# EAGLE design dual_switches (EAGLE 9.3.1)
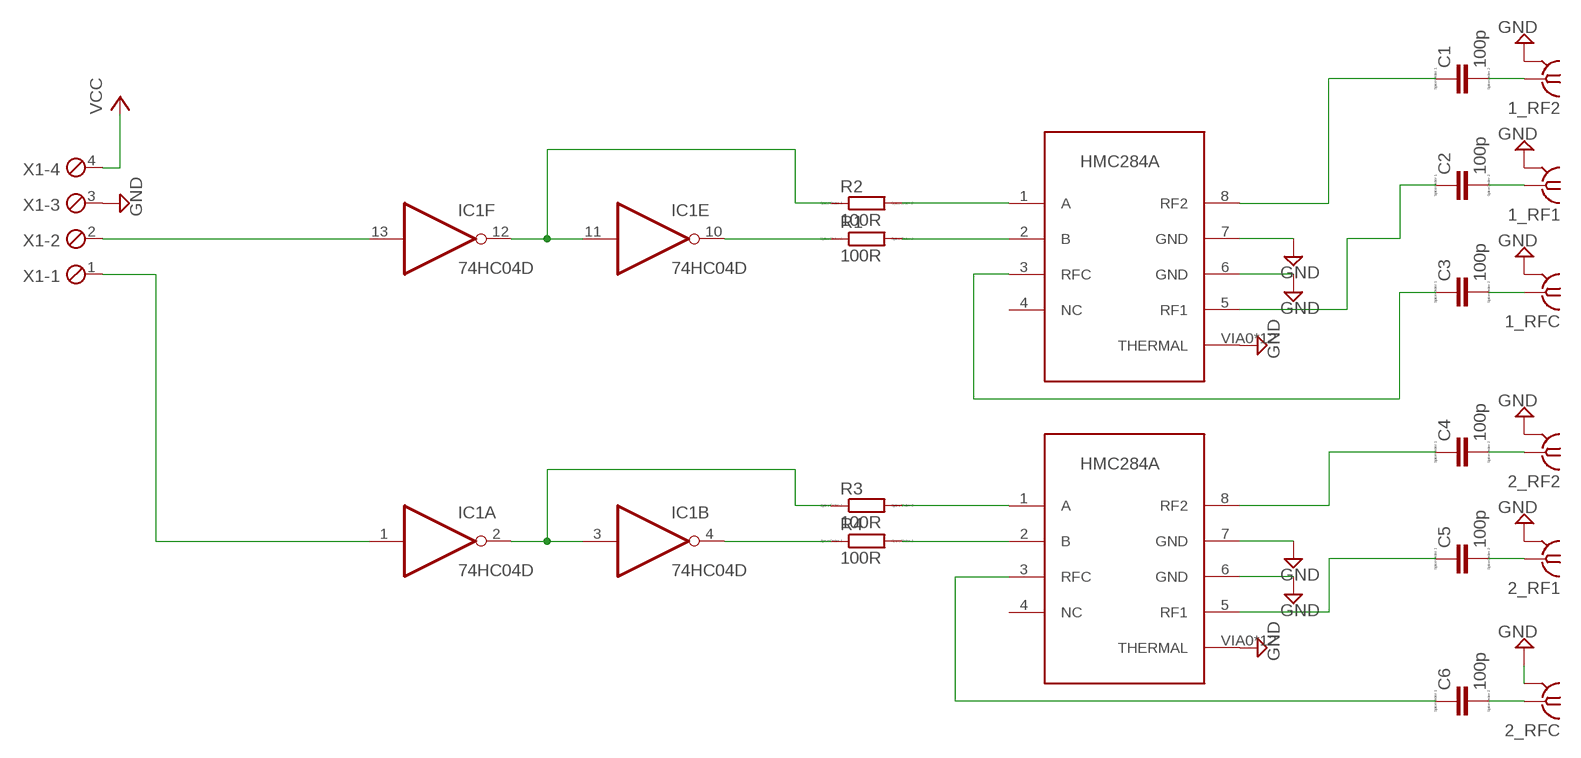
[diagram p0: schematic, sheet 1]

## Parts
1_RF1  SMA-142-0701-801/806  [J502-ND-142-0701-801/806]
1_RF2  SMA-142-0701-801/806  [J502-ND-142-0701-801/806]
1_RFC  SMA-142-0701-801/806  [J502-ND-142-0701-801/806]
2_RF1  SMA-142-0701-801/806  [J502-ND-142-0701-801/806]
2_RF2  SMA-142-0701-801/806  [J502-ND-142-0701-801/806]
2_RFC  SMA-142-0701-801/806  [J502-ND-142-0701-801/806]
C1  100p  CC0402  [C0402]
C2  100p  CC0402  [C0402]
C3  100p  CC0402  [C0402]
C4  100p  CC0402  [C0402]
C5  100p  CC0402  [C0402]
C6  100p  CC0402  [C0402]
IC1  74HC04D  [SO14]
R1  100R  RR0603  [R0603]
R2  100R  RR0603  [R0603]
R3  100R  RR0603  [R0603]
R4  100R  RR0603  [R0603]
U$1  HMC284A  [MSOP-8G]
U$2  HMC284A  [MSOP-8G]
X1  MPT4  [4POL254]

## Nets
GND: 1_RF1.G@1 1_RF1.G@2 1_RF1.G@3 1_RF1.G@4 1_RF2.G@1 1_RF2.G@2 1_RF2.G@3 1_RF2.G@4 1_RFC.G@1 1_RFC.G@2 1_RFC.G@3 1_RFC.G@4 2_RF1.G@1 2_RF1.G@2 2_RF1.G@3 2_RF1.G@4 2_RF2.G@1 2_RF2.G@2 2_RF2.G@3 2_RF2.G@4 2_RFC.G@1 2_RFC.G@2 2_RFC.G@3 2_RFC.G@4 U$1.6(GND) U$1.7(GND) U$1.VIA0(THERMAL) U$1.VIA1(THERMAL) U$1.VIA2(THERMAL) U$1.VIA3(THERMAL) U$1.VIA5(THERMAL) U$1.VIA6(THERMAL) U$1.VIA7(THERMAL) U$1.VIA8(THERMAL) U$1.VIA9(THERMAL) U$1.VIA10(THERMAL) U$1.VIA11(THERMAL) U$1.VIA12(THERMAL) U$2.6(GND) U$2.7(GND) U$2.VIA0(THERMAL) U$2.VIA1(THERMAL) U$2.VIA2(THERMAL) U$2.VIA3(THERMAL) U$2.VIA5(THERMAL) U$2.VIA6(THERMAL) U$2.VIA7(THERMAL) U$2.VIA8(THERMAL) U$2.VIA9(THERMAL) U$2.VIA10(THERMAL) U$2.VIA11(THERMAL) U$2.VIA12(THERMAL) X1.3
N$1 [Trace_normal]: IC1.13(F:I) X1.2
N$2 [Trace_normal]: IC1.11(E:I) IC1.12(F:O) R2.1
N$3 [Trace_normal]: IC1.2(A:O) IC1.3(B:I) R3.1
N$5 [Trace_normal]: R1.2 U$1.2(B)
N$6: C1.1 U$1.8(RF2)
N$7 [Trace_normal]: IC1.1(A:I) X1.1
N$8 [Trace_normal]: IC1.10(E:O) R1.1
N$9: C3.1 U$1.3(RFC)
N$10: C2.1 U$1.5(RF1)
N$11: C4.1 U$2.8(RF2)
N$12: C5.1 U$2.5(RF1)
N$13: C6.1 U$2.3(RFC)
N$14 [Trace_normal]: R2.2 U$1.1(A)
N$15 [Trace_normal]: R3.2 U$2.1(A)
N$16 [Trace_normal]: R4.2 U$2.2(B)
N$17: 2_RF1.1 C5.2
N$18: 2_RFC.1 C6.2
N$19: 2_RF2.1 C4.2
N$20: 1_RFC.1 C3.2
N$21: 1_RF1.1 C2.2
N$22: 1_RF2.1 C1.2
N$24 [Trace_normal]: IC1.4(B:O) R4.1
VCC: X1.4
Unconnected: IC1.5(C:I) IC1.6(C:O) IC1.8(D:O) IC1.9(D:I) U$1.4(NC) U$2.4(NC)

## Power pins joined to a net without a drawn wire
GND: IC1.7(P:GND)
VCC: IC1.14(P:VCC)

## Library data of the parts
1_RF1 1_RF2 1_RFC 2_RF1 2_RF2 2_RFC = con-coax:SMA-: SMA 50 Ohm End Launch Jack Receptacle - Round Contact Johnson Components Source: www.johnsoncomponents.com .. J502-ND.pdf; MF: JOHNSON COMPONENTS; MPN: 142-0701-801; OC_FARNELL: 1608592; OC_NEWARK: 90F2624
C1-C6 = eagle-ltspice:C: CAPACITOR, European symbol; SPICEMODEL: NONE; SPICEPREFIX: C
IC1 = 74xx-eu:74*04: Hex INVERTER
R1-R4 = eagle-ltspice:R: RESISTOR, European symbol; SPICEMODEL: NONE; SPICEPREFIX: R
U$1 U$2 = my_library:HMC284A: HMC284A DC - 3.5GHz dual RF switch
X1 = con-phoenix-254:MPT4: PHOENIX CONNECTOR; OC_FARNELL: unknown; OC_NEWARK: unknown

## Net classes
0 CPW_G: width 0.35 mm, drill 0.2 mm, clearance 0.2 mm
1 Trace_normal: width 0.15 mm, drill 0.2 mm, clearance 0.2 mm

## Board
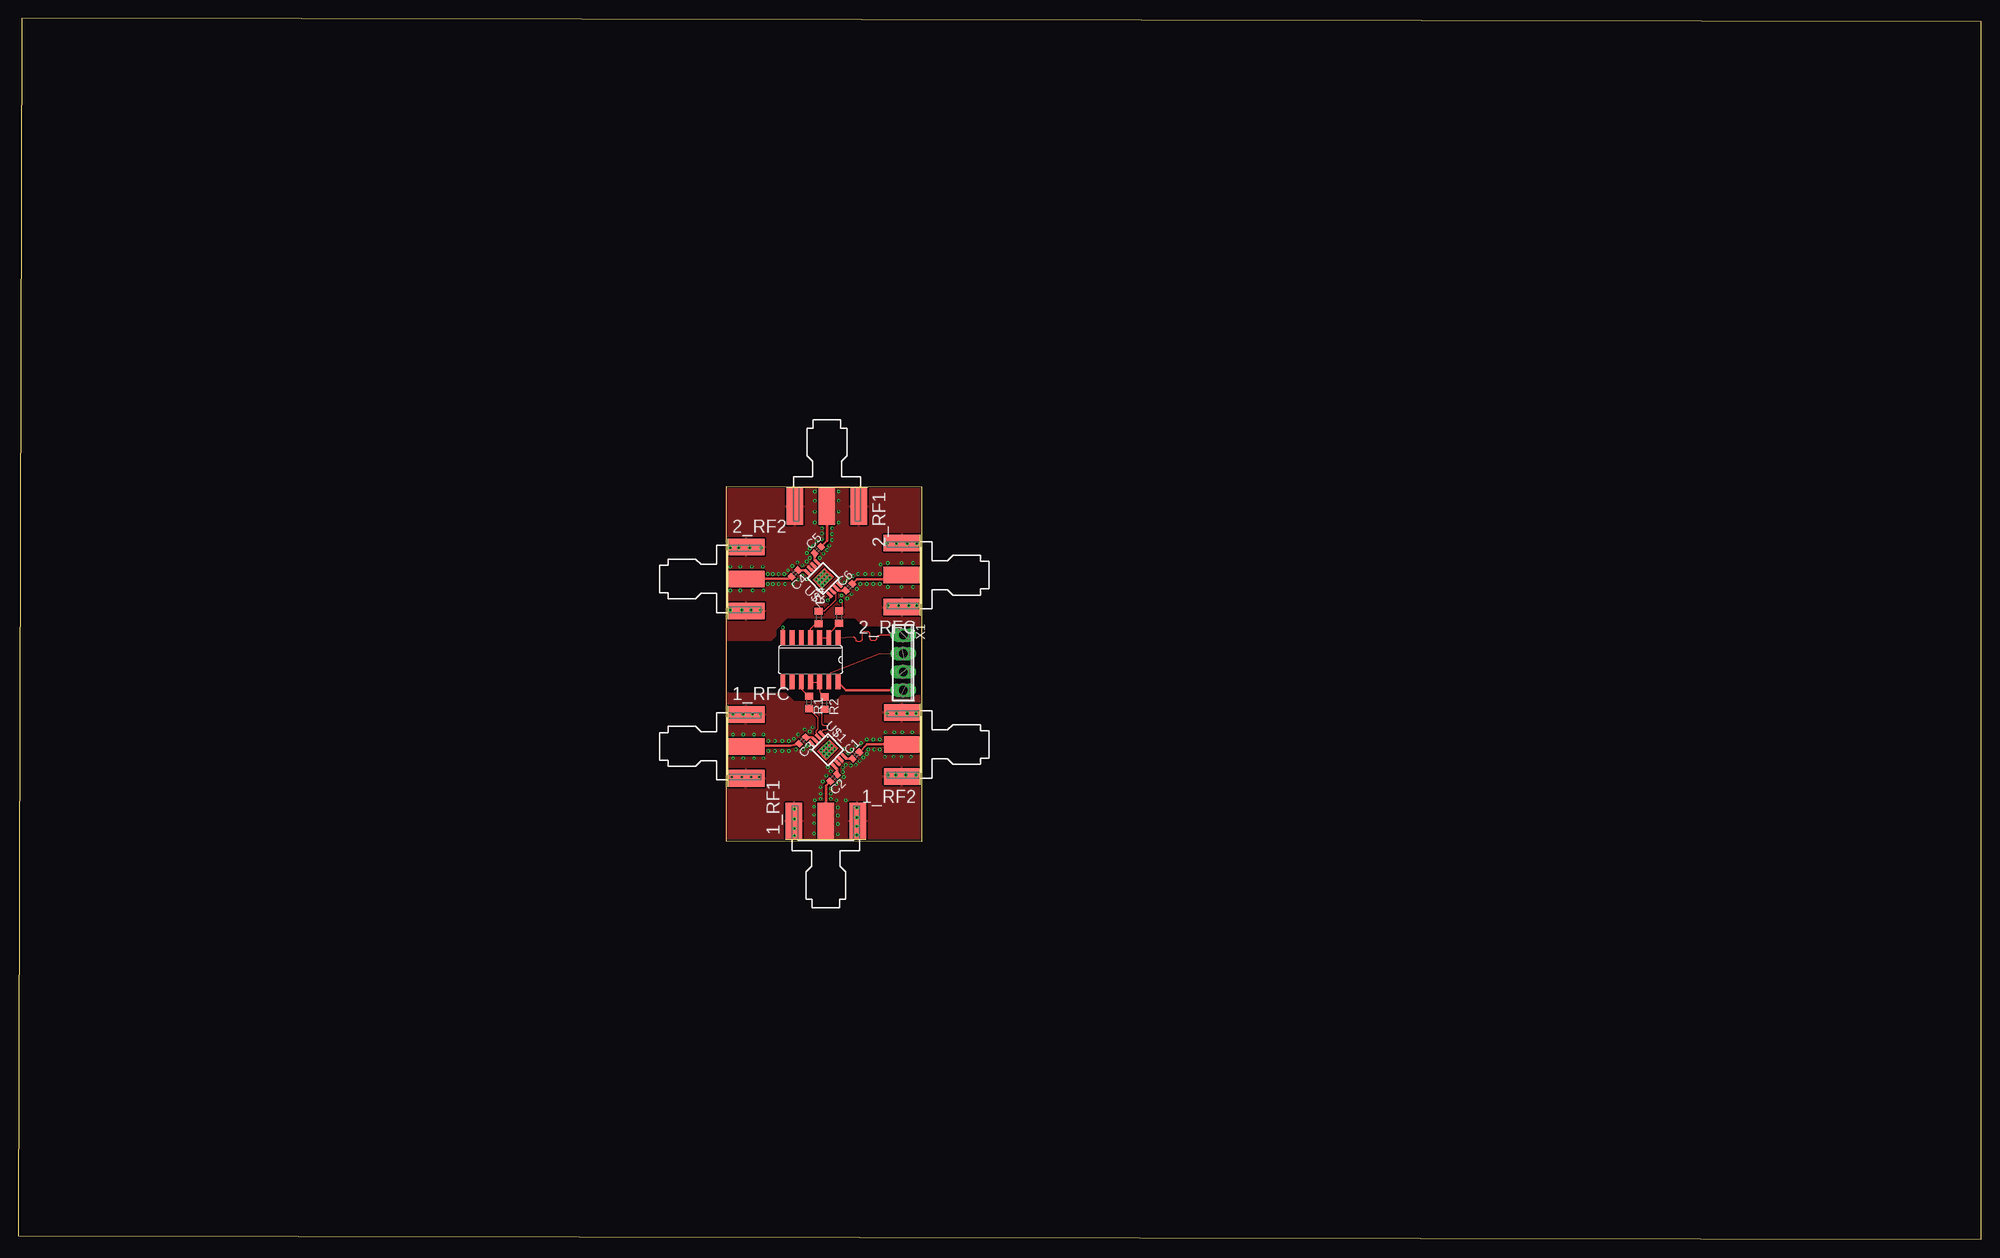
[diagram p1: board, top side]
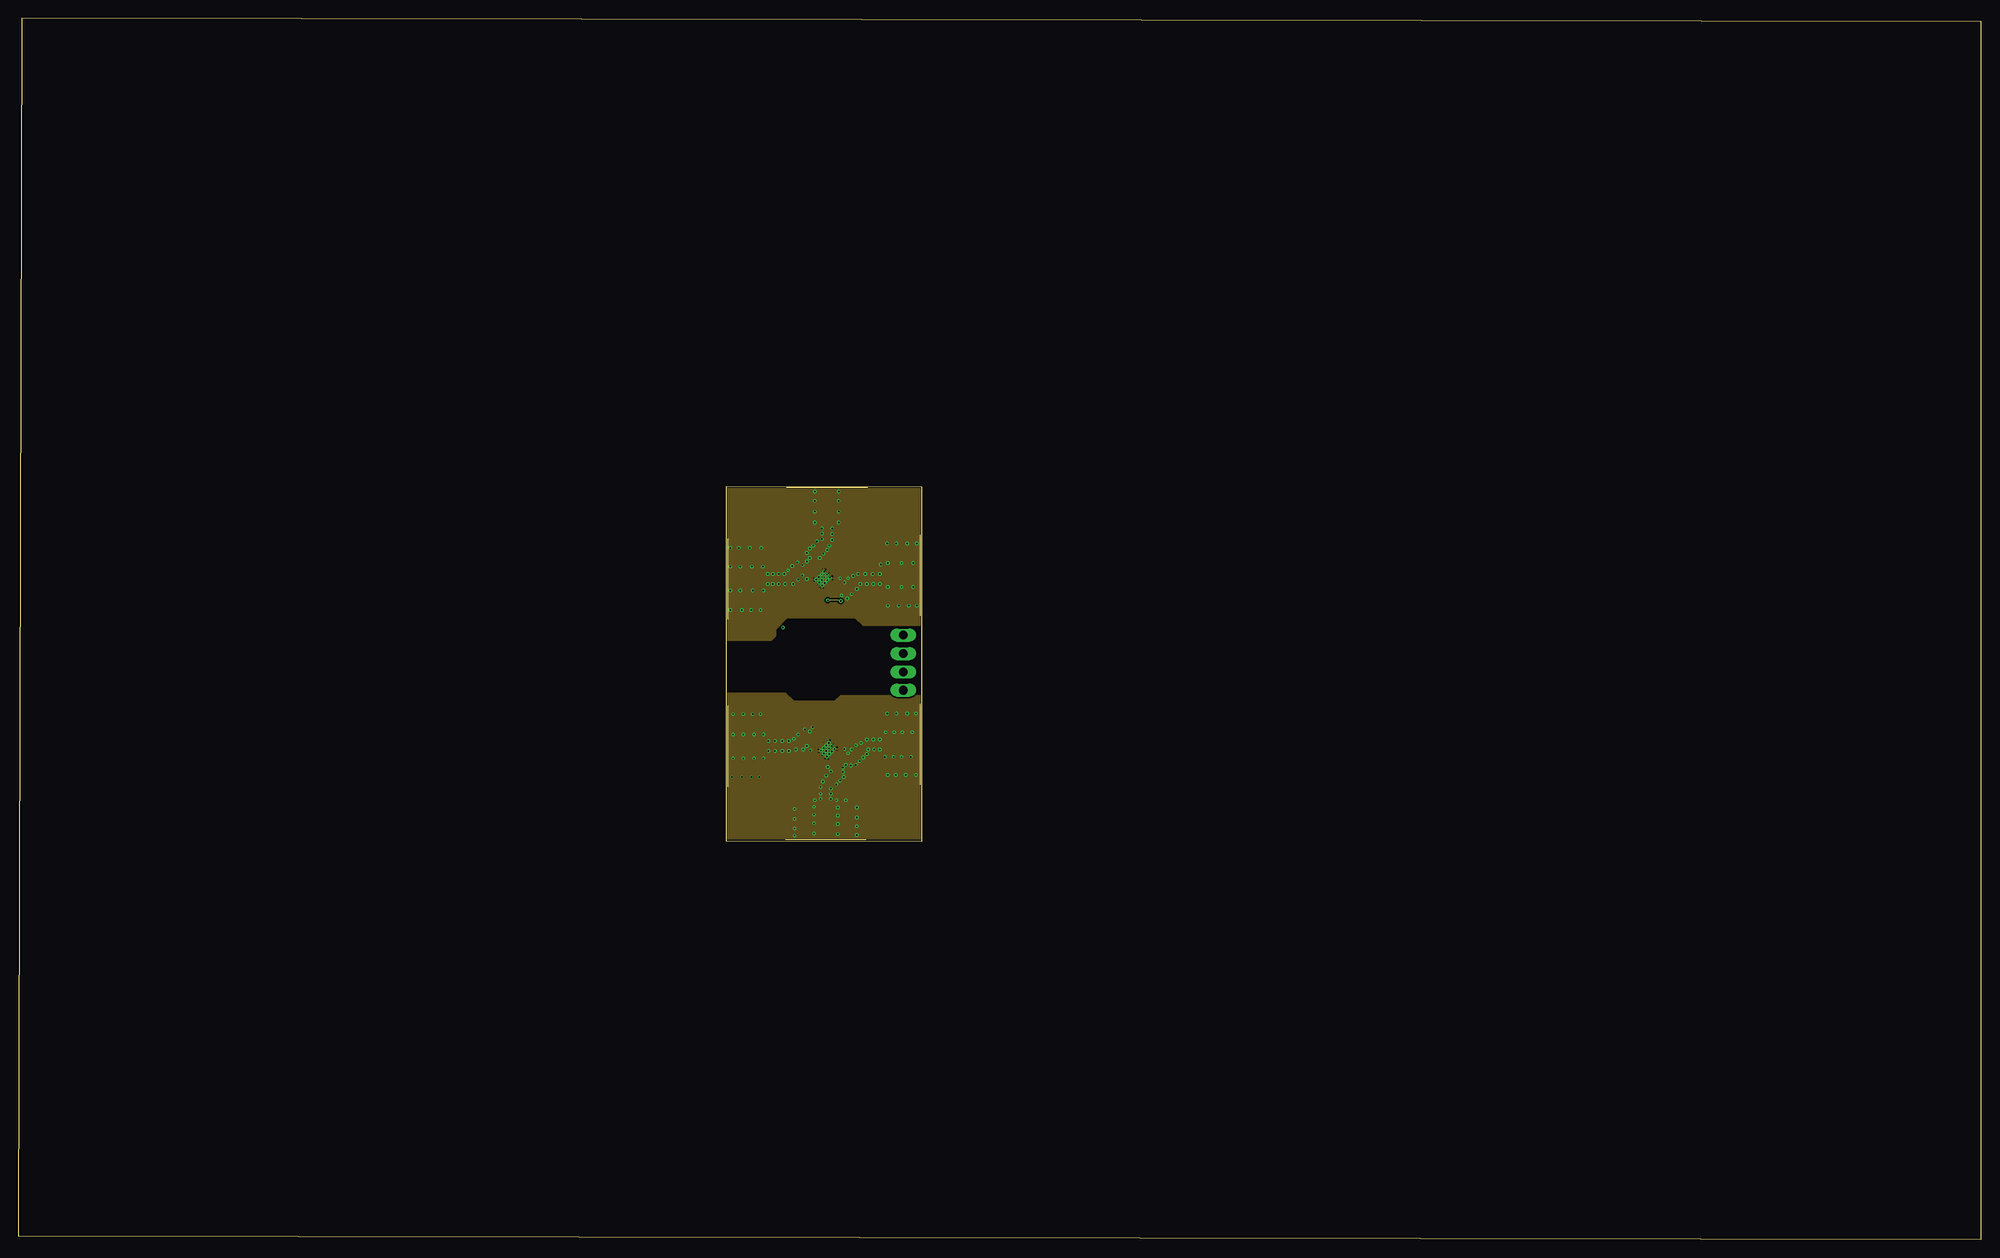
[diagram p2: board, inner layer Route2]
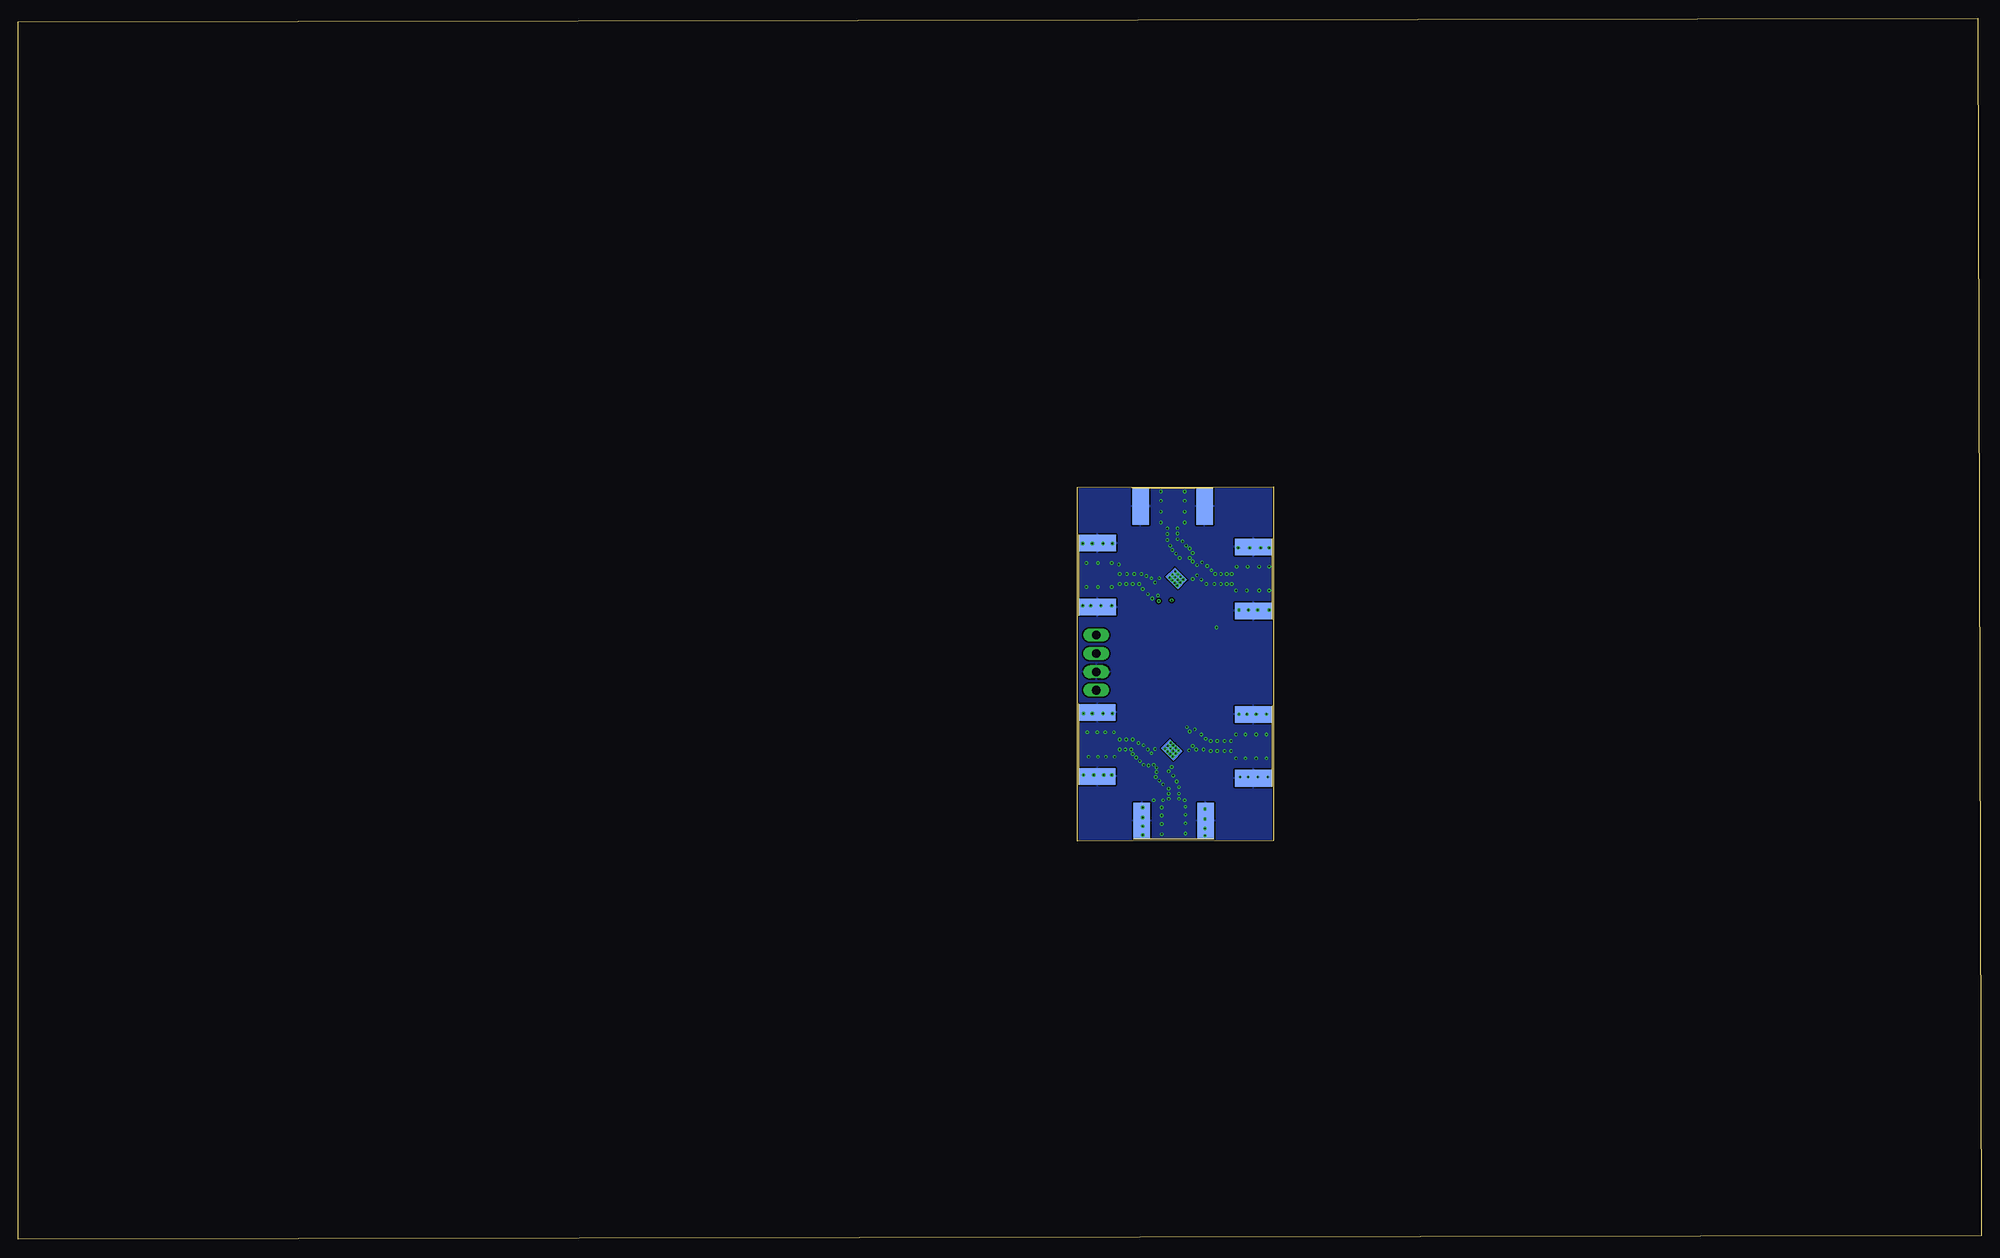
[diagram p3: board, bottom side, seen from below]

Size 271.57 x 168.9 mm. Coordinates in mm from the lower left corner, seen from the top.
Outline: 0,0.5 271.57,0 271.57,168.4 0.5,168.9 0,0.5
Outline: 97.92,55.17 125.03,55.09 125.03,103.99 97.92,104.07 97.92,55.17
Copper layers (1+2*15+16): Top 0.035mm / dielectric 0.2mm / Route2 0.0175mm / dielectric 1.065mm / Route15 0.0175mm / dielectric 0.2mm / Bottom 0.035mm
Design rules "default *": minimum track width 6mil, minimum drill 0.2mm, track to track 6mil, track to pad 5mil, pad to pad 5mil, via to via 5mil, smd to smd 5mil, copper to edge 3.5mil, drill to drill 5mil, minimum pad ring 3mil, minimum via ring 3mil, stop-mask expansion 4mil, vias tented up to drill 0mil, thermal gap 10mil

### Footprints (pad centres in the part's own frame; a part is rotated, then mirrored left to right if it is on the bottom)
J502-ND-142-0701-801/806 = smd 5.08 x 2.286: 1 2.565,0; G@1 2.565,4.42; G@2 2.565,-4.42 | smd 5.08 x 2.286 bottom: G@3 2.565,4.42; G@4 2.565,-4.42
C0402 = smd 0.7 x 0.9: 1 -0.65,0; 2 0.65,0
SO14 = smd 0.66 x 2.032: 1 -3.81,-3.073; 2 -2.54,-3.073; 3 -1.27,-3.073; 4 0,-3.073; 5 1.27,-3.073; 6 2.54,-3.073; 7 3.81,-3.073; 8 3.81,3.073; 9 2.54,3.073; 10 1.27,3.073; 11 0,3.073; 12 -1.27,3.073; 13 -2.54,3.073; 14 -3.81,3.073
R0603 = smd 1 x 1.1: 1 -0.85,0; 2 0.85,0
MSOP-8G = smd 0.4 x 1: 1 -0.975,-2.2; 2 -0.325,-2.2; 3 0.325,-2.2; 4 0.975,-2.2; 5 0.975,2.2; 6 0.325,2.2; 7 -0.325,2.2; 8 -0.975,2.2 | drill 0.2 pad 0.45: VIA0 -0.76,0.56; VIA1 -0.258,0.56; VIA2 0.245,0.56; VIA3 0.748,0.56; VIA5 -0.77,-0.02; VIA6 -0.268,-0.02; VIA7 0.235,-0.02; VIA8 0.738,-0.02; VIA9 -0.78,-0.59; VIA10 -0.278,-0.59; VIA11 0.225,-0.59; VIA12 0.728,-0.59
4POL254 = drill 1.2 long: 1 -3.81,0; 2 -1.27,0; 3 1.27,0; 4 3.81,0

### Placement (x,y rotation side)
1_RF1  111.72,55.32 90 top
1_RF2  124.85,68.46 180 top
1_RFC  98.14,68.2 0 top
2_RF1  111.89,103.95 270 top
2_RF2  98.14,91.34 0 top
2_RFC  124.84,91.86 180 top
C1  115.9,66.94 45 top
C2  112.8,63.84 225 top
C3  108.5,69 225 top
C4  107.44,92.11 225 top
C5  110.62,95.33 45 top
C6  114.94,90.2 45 top
IC1  109.6,80.16 180 top
R1  109.41,74.26 270 top
R2  111.57,74.17 270 top
R3  113.58,86.07 90 top
R4  110.75,86.01 90 top
U$1  112,67.71 225 top
U$2  111.36,91.42 45 top
X1  122.42,79.76 270 top

### Tracks (layer width: path | path; a pad name or v marks a point on that pad's centre or on a via)
GND  (via drill 0.2, 0.2 pad 0.45)
  Top 0.35: IC1.7 105.8,83.24 v105.8,84.64
  other vias: 100.1,63.94 102.5,63.94 98.7,63.94 98.9,72.64 100.3,72.64 102.7,72.64 103.8,67.54 104.7,67.54 105.7,67.54 106.6,67.54 107.6,67.74 108.6,67.74 109.1,68.24 109.6,67.64 103.8,68.94 104.7,68.94 105.7,68.94 106.6,68.94 107.3,69.24 107.9,69.84 109.5,70.24 108.8,70.54 109.9,70.84 101.6,72.64 101.4,63.94 124.2,72.74 123,72.74 121.5,72.74 120.2,72.74 124.2,64.24 122.8,64.24 120.3,64.24 121.4,64.24 119.2,67.74 118.4,67.74 117.6,67.74 114.5,65.64 114.1,65.24 115.2,65.54 114.1,64.64 117.4,67.14 116.9,66.64 116.4,66.14 115.9,65.64 114.2,63.94 113.7,63.44 113.2,62.94 112.4,62.34 112.4,61.64 112.4,60.94 113.2,60.74 114.5,60.74 113.4,59.74 113.4,58.64 113.4,57.44 113.4,56.04 111,60.94 111,61.64 111,62.54 111.3,63.34 111.8,64.14 112.4,64.74 112,65.34 119.2,69.14 118.3,69.14 117.4,69.14 116.6,68.64 115.9,68.34 115.3,67.74 114.8,67.24 114.3,67.84 120,70.14 121.2,70.14 122.3,70.14 123.7,70.14 119.9,66.74 121.1,66.74 122.2,66.74 123.5,66.74 110.2,60.74 110.1,59.84 110.1,58.74 110.1,57.54 110.1,56.14 107.4,55.84 107.4,56.84 107.4,58.14 107.4,59.54 116,55.94 116,57.14 116,58.34 116,59.74 103.1,69.84 101.8,69.84 100.3,69.84 98.9,69.84 98.9,66.54 100.3,66.54 101.8,66.54 103.1,66.54 112.6,98.34 112.6,97.54 112.6,96.74 112.2,95.94 111.2,96.84 111.2,98.34 111.2,97.64 113.5,99.14 113.5,103.44 113.5,102.14 113.5,100.64 110.2,99.14 110.2,100.64 110.2,102.14 110.2,103.44 111.9,95.34 111.4,94.84 110.9,94.24 109.5,94.24 109.1,93.74 108.5,93.24 107.8,93.64 109.1,94.94 110,95.94 110.5,96.54 109.5,95.54 108.5,91.84 109.1,91.34 107.2,90.64 107.9,91.24 106,92.04 106.5,92.54 107.1,93.14 105.2,92.04 104.4,92.04 103.7,92.04 103.7,90.64 104.4,90.64 105.2,90.64 106.1,90.64 98.5,87.04 100.1,87.04 101.4,87.04 102.7,87.04 98.5,95.64 99.7,95.64 101.2,95.64 102.8,95.64 103,93.04 103.1,89.74 98.5,89.74 98.5,93.04 99.9,93.04 101.5,93.04 101.6,89.74 99.9,89.74 119.2,92.04 118.2,92.04 117.2,92.04 116.2,92.04 116.5,90.64 117.4,90.64 118.3,90.64 119.2,90.64 119.3,93.34 120.3,93.54 122.2,93.54 123.8,93.54 120.3,90.24 122.2,90.24 123.8,90.24 116,89.94 115.3,89.24 114.7,88.64 113.9,89.04 114.3,90.84 113.7,91.44 114.8,91.44 115.5,91.74 124.3,96.24 123,96.24 121.5,96.24 120.2,96.24 124.3,87.64 123.2,87.64 121.8,87.64 120.3,87.64
  pour Bottom: 98,55.12 124.88,55.12 124.89,55.13 124.89,103.97 124.88,103.98 98.07,103.98
  pour Top: 98.07,103.97 98.07,82.9 98.09,82.88 104.2,82.88 104.3,82.98 104.83,83.51 104.83,84.41 106.37,85.95 115.8,85.95 116.86,84.89 124.85,84.89 124.85,103.96 124.83,103.98 98.13,103.98 98.11,103.96 98.1,103.96 98.09,103.95
  pour Route2: 98.08,82.89 104.22,82.89 104.83,83.5 104.83,84.38 104.82,84.39 106.38,85.95 106.42,85.95 115.82,85.95 115.84,85.93 116.85,84.92 116.85,84.89 116.87,84.91 124.85,84.91 124.85,103.97 98.08,103.97 98.07,103.96 98.07,82.9
  pour Top: 98.2,75.55 98.18,75.57 106.07,75.57 107.23,74.41 112.98,74.41 113.02,74.37 113.9,75.25 117.55,75.25 124.83,75.25 124.83,55.34 124.82,55.33 98.18,55.33 98.19,55.34 98.19,55.47
  pour Route2: 98.23,55.36 98.23,75.57 98.24,75.58 98.25,75.59 98.97,75.59 106.12,75.59 107.24,74.47 113.03,74.47 113.85,75.29 124.81,75.29 124.81,55.39 124.76,55.34 98.25,55.34
N$1
  Top 0.152: X1.2 119.2,81.04 112.5,78.44 112.14,78.08 IC1.13
N$2
  Top 0.152: R2.1 110.87,75.72 IC1.12 IC1.11
N$3
  Top 0.152: R3.1 112.14,83.78 IC1.2 IC1.3
N$5
  Top 0.152: R1.2 110.67,72.15 110.67,70.59 110.36,70.28 110.36,70.05 110.67,69.74 U$1.2
N$6
  Top 0.35: U$1.8 114.61,66.48 C1.1
N$7
  Top 0.152: IC1.1 113.43,83.21 | IC1.1 113.49,83.15 113.49,82.41 | X1.1 119.2,83.54 119.1,83.54 arc90 118.79,83.2 arc-90 118.48,82.85 118.14,82.84 arc-90 117.8,83.14 117.77,83.8 arc90 117.42,84.1 117.08,84.09 arc90 116.78,83.74 116.81,83.09 arc-90 116.5,82.75 116.16,82.73 arc-90 115.82,83.04 arc90 115.48,83.34 IC1.1
N$8
  Top 0.152: IC1.10 108.33,76.19 R1.1
N$9
  Top 0.35: U$1.3 109.79,69.46 C3.1
N$10
  Top 0.35: U$1.5 113.26,65.07 C2.1
N$11
  Top 0.35: U$2.8 108.83,92.57 C4.1
N$12
  Top 0.35: U$2.5 110.16,94 C5.1
N$13
  Top 0.35: C6.1 114.03,89.74 113.97,89.68 113.56,89.68 U$2.3
N$14
  Top 0.152: R2.2 111.54,73.29 111.13,72.88 111.13,71.45 arc90 111.46,71.13 111.65,71.13 arc-90 111.97,70.8 111.97,70.77 arc-90 111.65,70.45 111.46,70.45 arc90 111.13,70.12 U$1.1
N$15  (via drill 0.2 pad 0.45)
  Top 0.152: v113.8,88.29 113.99,88.1 113.99,87.33 R3.2 | U$2.1 112.23,88.63 v111.99,88.39
  Route2 0.152: v113.8,88.29 113.39,88.39 v111.99,88.39
N$16
  Top 0.152: U$2.2 113.06,89.26 113.06,88.42 111.5,86.86 R4.2
N$17
  Top 0.35: C5.2 111.89,96.59 2_RF1.1
N$18
  Top 0.35: C6.2 116.06,91.32 121.73,91.32 2_RFC.1
N$19
  Top 0.35: C4.2 106.67,91.34 2_RF2.1
N$20
  Top 0.35: 1_RFC.1 103.4,68.24 106.8,68.24 C3.2
N$21
  Top 0.35: C2.2 111.72,62.77 1_RF1.1
N$22
  Top 0.35: 1_RF2.1 117.42,68.46 C1.2
N$24
  Top 0.152: IC1.4 109.6,84.45 110.31,85.16 R4.1
VCC
  Top 0.35: X1.4 114.55,75.95 IC1.14